# Altium schematic sheet analog_channel3.SchDoc
size A4; SheetNumber: 6; SheetTotal: 6
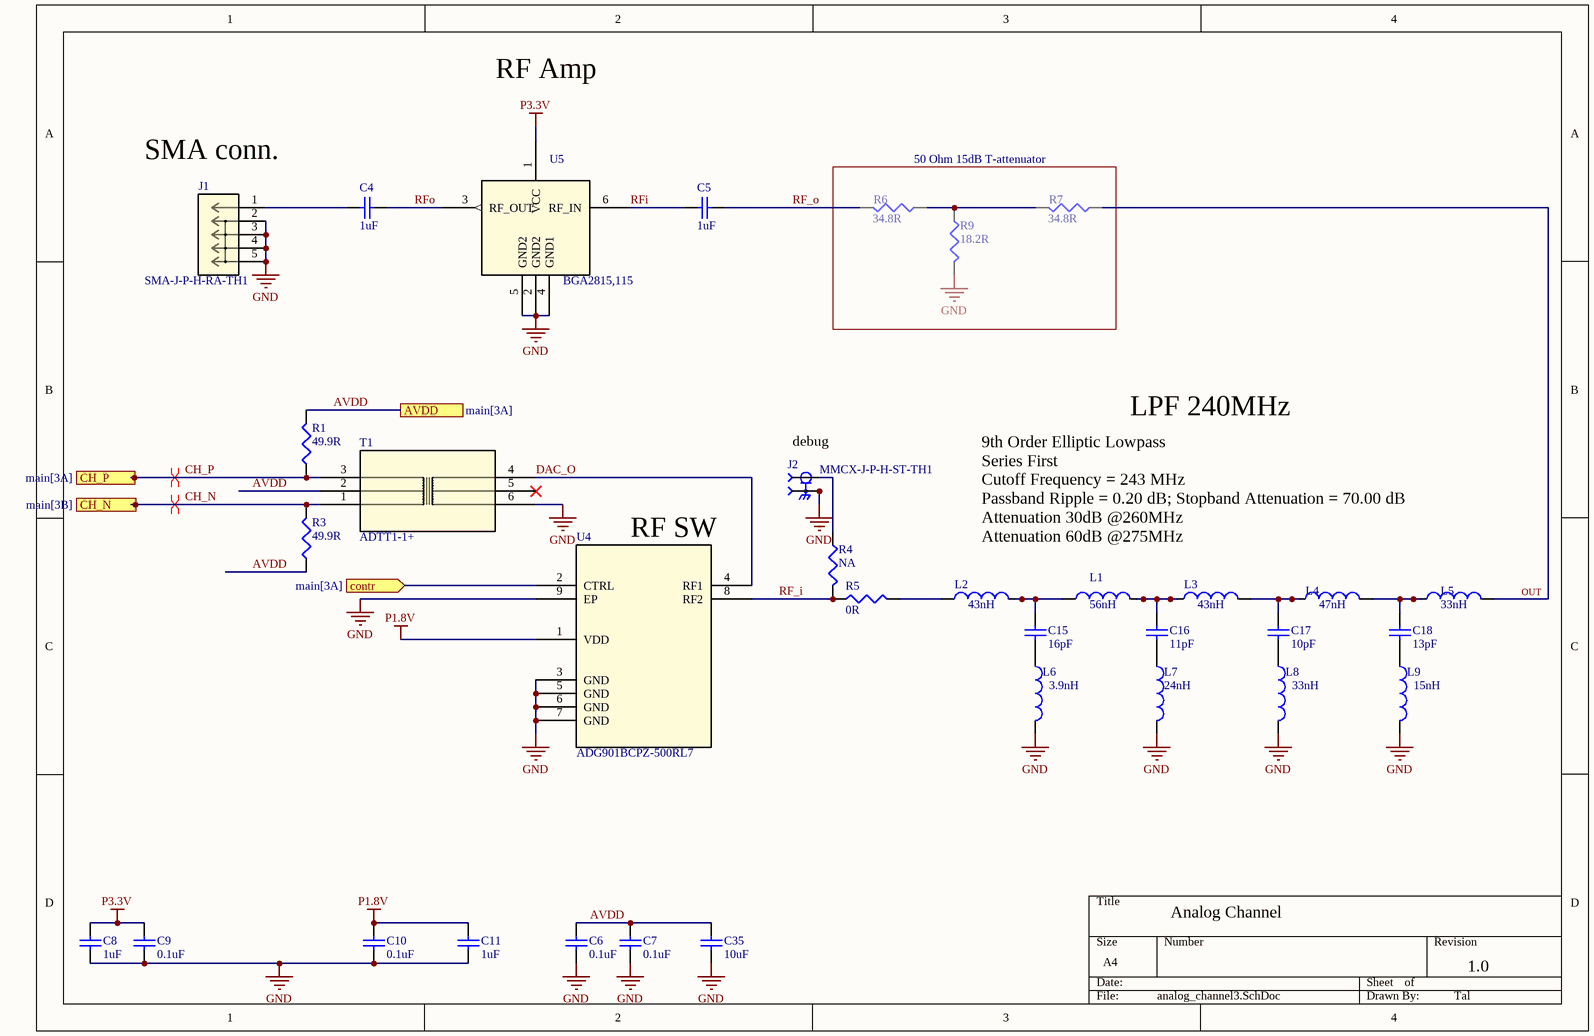
[diagram p0: analog_channel3.SchDoc]

## Parts
C4  Capacitance: 1uF  [C0402]  (hidden comment: 1uF 25V)
C5  Capacitance: 1uF  [C0402]  (hidden comment: 1uF 25V)
C6  Capacitance: 0.1uF  [C0402]  (hidden comment: 0.1uF 50V)
C7  Capacitance: 0.1uF  [C0402]  (hidden comment: 0.1uF 50V)
C8  Capacitance: 1uF  [C0402]  (hidden comment: 1uF 25V)
C9  Capacitance: 0.1uF  [C0402]  (hidden comment: 0.1uF 50V)
C10  Capacitance: 0.1uF  [C0402]  (hidden comment: 0.1uF 50V)
C11  Capacitance: 1uF  [C0402]  (hidden comment: 1uF 25V)
C15  Capacitance: 16pF  [C0402]  (hidden comment: 16pF 50V)
C16  Capacitance: 11pF  [C0402]  (hidden comment: 11pF 50V)
C17  Capacitance: 10pF  [C0402]  (hidden comment: 10pF 50V)
C18  Capacitance: 13pF  [C0402]  (hidden comment: 13pF 50V)
C35  Capacitance: 10uF  [C0402]  (hidden comment: 10uF 10V)
J1  SMA-J-P-H-RA-TH1  [CONN_SMA-J-P-H-RA-TH1_SAI]
J2  MMCX-J-P-H-ST-TH1  [SAMTEC_MMCX-J-P-H-ST-TH1]
L1  value 56nH  [0402-A]  (hidden comment: Inductor)
L2  value 43nH  [0402-A]  (hidden comment: Inductor)
L3  value 43nH  [0402-A]  (hidden comment: Inductor)
L4  value 47nH  [0402-A]  (hidden comment: Inductor)
L5  value 33nH  [0402-A]  (hidden comment: Inductor)
L6  value 3.9nH  [0402-A]  (hidden comment: Inductor)
L7  value 24nH  [0402-A]  (hidden comment: Inductor)
L8  value 33nH  [0402-A]  (hidden comment: Inductor)
L9  value 15nH  [0402-A]  (hidden comment: Inductor)
R1  49.9R  [R0402]
R3  49.9R  [R0402]
R4  NA  [r0402]
R5  0R  [r0402]
R6  34.8R  [r0402]
R7  34.8R  [r0402]
R9  18.2R  [r0402]
T1  ADTT1-1+  [CD542_MNC]
U4  ADG901BCPZ-500RL7  [CP_8_2_ADI]
U5  BGA2815,115  [SOT_2815,115_NXP]

## Blocks framed on the sheet
50 Ohm 15dB T-attenuator: R6 R7 R9

## Ports
AVDD (see main[3A]), CH_N (in, see main[3B]), CH_P (in, see main[3A]), contr (in, see main[3A])

## Nets
GND: C6.1 C7.1 C8.1 C9.1 C10.1 C11.1 C35.1 J1.2 J1.3 J1.4 J1.5 J2.S1 J2.S2 J2.S3 J2.S4 L6.2 L7.2 L8.2 L9.2 R9.2 T1.6 U4.3(GND) U4.5(GND) U4.6(GND) U4.7(GND) U4.9(EP) U5.2(GND2) U5.4(GND1) U5.5(GND2)
P1.8V: C10.2 C11.2 U4.1(VDD)
P3.3V: C8.2 C9.2 U5.1(VCC)
AVDD: C6.2 C7.2 C35.2 R1.2 R3.1 T1.2 ; port AVDD
CH_N: R3.2 T1.1 ; port CH_N
CH_P: R1.1 T1.3 ; port CH_P
contr: U4.2(CTRL) ; port contr
DAC_O: T1.4 U4.4(RF1)
OUT: L5.2 R7.1
RF_i: R4.2 R5.1 U4.8(RF2)
RF_o: C5.2 R6.2
RFi: C5.1 U5.6(RF_IN)
RFo: C4.2 U5.3(RF_OUT)
NetC4_1: C4.1 J1.1
NetC15_1: C15.1 L1.1 L2.2
NetC15_2: C15.2 L6.1
NetC16_1: C16.1 L1.2 L3.1
NetC16_2: C16.2 L7.1
NetC17_1: C17.1 L3.2 L4.1
NetC17_2: C17.2 L8.1
NetC18_1: C18.1 L4.2 L5.1
NetC18_2: C18.2 L9.1
NetJ2_1: J2.1 R4.1
NetL2_1: L2.1 R5.2
NetR6_1: R6.1 R7.2 R9.1

Not connected (* = marked no-connect by the designer): T1 5*

## Layout directives
differential pair: CH_N, CH_P

## Notes on the sheet
- RF Amp
- (near J1) SMA conn.
- (near J2) debug
- LPF 240MHz
- (near U4) RF SW
- 9th Order Elliptic Lowpass
  Series First
  Cutoff Frequency = 243 MHz
  Passband Ripple = 0.20 dB; Stopband Attenuation = 70.00 dB
  Attenuation 30dB @260MHz
  Attenuation 60dB @275MHz
- Analog Channel
- 1.0
- Tal

## Library data of the parts
C4 C5 C8 C11 = CAP CER 6.8pF 50V NP0 0402: CAP CER 1uF 25V X5R 0402; Manufacturer Part Number: C1005C0G1H6R8D; Manufacturer: TDK Corporation; LANDA P/N: ECP-000033; Voltage - Rated: 50V; RoHS: RoHS Compliant; Package / Case: 0402 (1005 Metric); ComponentLink1URL: http://www.tdk.com/pdf/general_B11.pdf; ComponentLink1Description: http://www.tdk.com/pdf/general_B11.pdf
C6 C7 C9 C10 = CAP CER 6.8pF 50V NP0 0402: CAP CER 0.1uF 50V NP0 0402; Manufacturer Part Number: C1005C0G1H6R8D; Manufacturer: TDK Corporation; LANDA P/N: ECP-000033; RoHS: RoHS Compliant; Package / Case: 0402 (1005 Metric); ComponentLink1URL: http://www.tdk.com/pdf/general_B11.pdf; ComponentLink1Description: http://www.tdk.com/pdf/general_B11.pdf; Voltage - Rated: 50V
C15 = CAP CER 20pF 50V 5% NP0 0402: CAP CER 16PF 50V 5% NP0 0402; Manufacturer: TDK Corporation; Manufacturer Part Number: C1005C0G1H200J; LANDA P/N: ECP-000034; Package / Case: 0402 (1005 Metric); RoHS: RoHS Compliant; ComponentLink1URL: http://www.tdk.com/pdf/general_B11.pdf; ComponentLink1Description: http://www.tdk.com/pdf/general_B11.pdf; Voltage - Rated: 50V
C16 = CAP CER 20pF 50V 5% NP0 0402: CAP CER 11PF 50V 5% NP0 0402; Manufacturer: TDK Corporation; Manufacturer Part Number: C1005C0G1H200J; LANDA P/N: ECP-000034; Package / Case: 0402 (1005 Metric); RoHS: RoHS Compliant; ComponentLink1URL: http://www.tdk.com/pdf/general_B11.pdf; ComponentLink1Description: http://www.tdk.com/pdf/general_B11.pdf; Voltage - Rated: 50V
C17 = CAP CER 20pF 50V 5% NP0 0402: CAP CER 10PF 50V 5% NP0 0402; Manufacturer: TDK Corporation; Manufacturer Part Number: C1005C0G1H200J; LANDA P/N: ECP-000034; Package / Case: 0402 (1005 Metric); RoHS: RoHS Compliant; ComponentLink1URL: http://www.tdk.com/pdf/general_B11.pdf; ComponentLink1Description: http://www.tdk.com/pdf/general_B11.pdf; Voltage - Rated: 50V
C18 = CAP CER 20pF 50V 5% NP0 0402: CAP CER 13PF 50V 5% NP0 0402; Manufacturer: TDK Corporation; Manufacturer Part Number: C1005C0G1H200J; LANDA P/N: ECP-000034; Package / Case: 0402 (1005 Metric); RoHS: RoHS Compliant; ComponentLink1URL: http://www.tdk.com/pdf/general_B11.pdf; ComponentLink1Description: http://www.tdk.com/pdf/general_B11.pdf; Voltage - Rated: 50V
C35 = CAP CER 6.8pF 50V NP0 0402: CAP CER 10uF 10V X5R 0402; Manufacturer Part Number: C1005C0G1H6R8D; Manufacturer: TDK Corporation; LANDA P/N: ECP-000033; Voltage - Rated: 50V; RoHS: RoHS Compliant; Package / Case: 0402 (1005 Metric); ComponentLink1URL: http://www.tdk.com/pdf/general_B11.pdf; ComponentLink1Description: http://www.tdk.com/pdf/general_B11.pdf
J1 = SMA-J-P-H-RA-TH1: No Description Available; Mfr_Name: Samtec Inc; Copyright: Copyright (C) 2023 Ultra Librarian. All rights reserved.; Manufacturer_Part_Number: SMA-J-P-H-RA-TH1; RefDes: RefDes; Type: DEV
J2 = MMCX-J-P-H-ST-TH1: MMCX STRAIGHT, THROUGH HOLE JACK- 50 OHM; MF: Samtec; MP: MMCX-J-P-H-ST-TH1; Price: None; Package: None; Value: *; Availability: Unavailable
L1-L9 = Inductor: Code_IEC: 1005; Published: 8-Jun-2000; LatestRevisionDate: 29-May-2009; LatestRevisionNote: IPC-7351 Footprint Added.; PackageReference: 0402-A; Publisher: Altium Limited; PackageDescription: Chip Inductor; Code_JEITA: 0402
R1 R3 = RES 100 OHM 1/10W 1% 0402 SMD: RES 49.9 OHM 1/10W 1% 0402 SMD; Manufacturer Part Number: ERJ-2RKF1000X; Manufacturer: Panasonic Electronic Components; LANDA P/N: ERS-000079; Assembly: N.C; Package / Case: 0402 (1005 Metric); RoHS: RoHS Compliant; ComponentLink1URL: http://industrial.panasonic.com/www-cgi/jvcr13pz.cgi?E+PZ+3+AOA0002+ERJ2RKF1000X+7+WW; ComponentLink1Description: http://industrial.panasonic.com/www-cgi/jvcr13pz.cgi?E+PZ+3+AOA0002+ERJ2RKF1000X+7+WW; Supplier Device Package: 0402
R4 R5 = RES 100 OHM 1/10W 1% 0402 SMD: RES 0 OHM 1/10W 1% 0402 SMD; Manufacturer Part Number: ERJ-2RKF1000X; Manufacturer: Panasonic Electronic Components; LANDA P/N: ERS-000079; Assembly: N.C; Package / Case: 0402 (1005 Metric); RoHS: RoHS Compliant; ComponentLink1URL: http://industrial.panasonic.com/www-cgi/jvcr13pz.cgi?E+PZ+3+AOA0002+ERJ2RKF1000X+7+WW; ComponentLink1Description: http://industrial.panasonic.com/www-cgi/jvcr13pz.cgi?E+PZ+3+AOA0002+ERJ2RKF1000X+7+WW; Supplier Device Package: 0402
R6 R7 = RES 100 OHM 1/10W 1% 0402 SMD: RES 34.8 OHM 1/10W 1% 0402 SMD; Manufacturer Part Number: ERJ-2RKF1000X; Manufacturer: Panasonic Electronic Components; LANDA P/N: ERS-000079; Assembly: N.C; Package / Case: 0402 (1005 Metric); RoHS: RoHS Compliant; ComponentLink1URL: http://industrial.panasonic.com/www-cgi/jvcr13pz.cgi?E+PZ+3+AOA0002+ERJ2RKF1000X+7+WW; ComponentLink1Description: http://industrial.panasonic.com/www-cgi/jvcr13pz.cgi?E+PZ+3+AOA0002+ERJ2RKF1000X+7+WW; Supplier Device Package: 0402
R9 = RES 100 OHM 1/10W 1% 0402 SMD: RES 18.2 OHM 1/10W 1% 0402 SMD; Manufacturer Part Number: ERJ-2RKF1000X; Manufacturer: Panasonic Electronic Components; LANDA P/N: ERS-000079; Assembly: N.C; Package / Case: 0402 (1005 Metric); RoHS: RoHS Compliant; ComponentLink1URL: http://industrial.panasonic.com/www-cgi/jvcr13pz.cgi?E+PZ+3+AOA0002+ERJ2RKF1000X+7+WW; ComponentLink1Description: http://industrial.panasonic.com/www-cgi/jvcr13pz.cgi?E+PZ+3+AOA0002+ERJ2RKF1000X+7+WW; Supplier Device Package: 0402
T1 = ADTT1-1+: No Description Available; Mfr_Name: Mini Circuits; Type: DEV; Copyright: Copyright (C) 2023 Ultra Librarian. All rights reserved.; Manufacturer_Part_Number: ADTT1-1+; RefDes: RefDes
U4 = ADG901BCPZ-500RL7: No Description Available; Mfr_Name: Analog Devices Inc; Copyright: Copyright (C) 2023 Ultra Librarian. All rights reserved.; Manufacturer_Part_Number: ADG901BCPZ-500RL7; RefDes: RefDes; Type: DEV
U5 = BGA2815,115: No Description Available; Mfr_Name: NXP; Copyright: Copyright (C) 2023 Ultra Librarian. All rights reserved.; Manufacturer_Part_Number: BGA2815,115; RefDes: RefDes; Type: DEV